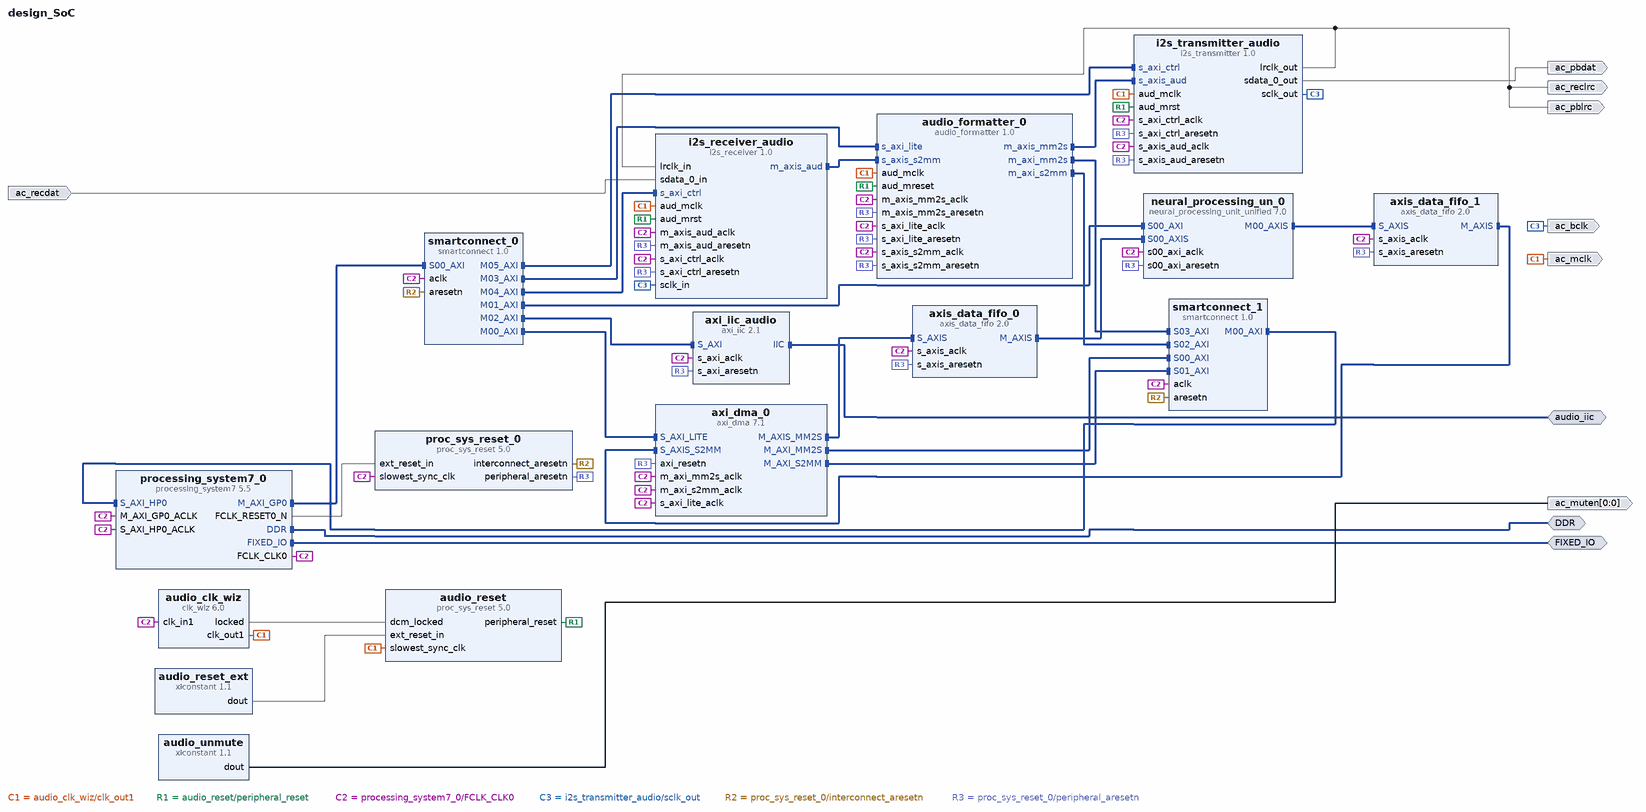
[diagram p0: block diagram of the top level]
# Vivado block design design_SoC, xc7z020clg400-1, Vivado 2024.2
create_bd_design design_SoC

create_bd_intf_port -mode Master -vlnv xilinx.com:interface:ddrx_rtl:1.0 DDR
create_bd_intf_port -mode Master -vlnv xilinx.com:display_processing_system7:fixedio_rtl:1.0 FIXED_IO
create_bd_intf_port -mode Master -vlnv xilinx.com:interface:iic_rtl:1.0 audio_iic
create_bd_port -dir O -type clk ac_mclk
set_property -dict {CONFIG.FREQ_HZ 12288982} [get_bd_ports ac_mclk]
create_bd_port -dir O -from 0 -to 0 ac_muten
create_bd_port -dir O ac_pbdat
create_bd_port -dir I ac_recdat
create_bd_port -dir O -type clk ac_bclk
set_property -dict {CONFIG.FREQ_HZ 2048000} [get_bd_ports ac_bclk]
create_bd_port -dir O ac_pblrc
create_bd_port -dir O ac_reclrc

create_bd_cell -type ip -vlnv xilinx.com:ip:proc_sys_reset:5.0 proc_sys_reset_0
create_bd_cell -type ip -vlnv xilinx.com:ip:axis_data_fifo:2.0 axis_data_fifo_0
create_bd_cell -type ip -vlnv xilinx.com:ip:axis_data_fifo:2.0 axis_data_fifo_1
set_property -dict {CONFIG.HAS_TKEEP 1 CONFIG.HAS_TLAST 1 CONFIG.HAS_TSTRB 0} [get_bd_cells axis_data_fifo_1]
create_bd_cell -type ip -vlnv xilinx.com:ip:smartconnect:1.0 smartconnect_0
set_property -dict {CONFIG.NUM_MI 6 CONFIG.NUM_SI 1} [get_bd_cells smartconnect_0]
create_bd_cell -type ip -vlnv xilinx.com:ip:axi_dma:7.1 axi_dma_0
set_property -dict {CONFIG.c_include_sg 0 CONFIG.c_sg_length_width 24} [get_bd_cells axi_dma_0]
create_bd_cell -type ip -vlnv xilinx.com:ip:smartconnect:1.0 smartconnect_1
set_property -dict {CONFIG.NUM_SI 4} [get_bd_cells smartconnect_1]
create_bd_cell -type ip -vlnv xilinx.com:ip:processing_system7:5.5 processing_system7_0
set_property -dict [list \
  CONFIG.PCW_APU_PERIPHERAL_FREQMHZ 667 \
  CONFIG.PCW_ENET0_ENET0_IO {MIO 16 .. 27} \
  CONFIG.PCW_ENET0_GRP_MDIO_ENABLE 1 \
  CONFIG.PCW_ENET0_GRP_MDIO_IO {MIO 52 .. 53} \
  CONFIG.PCW_ENET0_PERIPHERAL_ENABLE 1 \
  CONFIG.PCW_ENET0_RESET_ENABLE 0 \
  CONFIG.PCW_ENET_RESET_ENABLE 1 \
  CONFIG.PCW_ENET_RESET_SELECT {Share reset pin} \
  CONFIG.PCW_FPGA0_PERIPHERAL_FREQMHZ 75 \
  CONFIG.PCW_GPIO_MIO_GPIO_ENABLE 1 \
  CONFIG.PCW_GPIO_MIO_GPIO_IO MIO \
  CONFIG.PCW_I2C_RESET_ENABLE 0 \
  CONFIG.PCW_PRESET_BANK1_VOLTAGE {LVCMOS 1.8V} \
  CONFIG.PCW_QSPI_GRP_FBCLK_ENABLE 1 \
  CONFIG.PCW_QSPI_GRP_FBCLK_IO {MIO 8} \
  CONFIG.PCW_QSPI_GRP_SINGLE_SS_ENABLE 1 \
  CONFIG.PCW_QSPI_GRP_SINGLE_SS_IO {MIO 1 .. 6} \
  CONFIG.PCW_QSPI_PERIPHERAL_ENABLE 1 \
  CONFIG.PCW_QSPI_QSPI_IO {MIO 1 .. 6} \
  CONFIG.PCW_SD0_GRP_CD_ENABLE 1 \
  CONFIG.PCW_SD0_GRP_CD_IO {MIO 47} \
  CONFIG.PCW_SD0_GRP_WP_ENABLE 0 \
  CONFIG.PCW_SD0_PERIPHERAL_ENABLE 1 \
  CONFIG.PCW_SD0_SD0_IO {MIO 40 .. 45} \
  CONFIG.PCW_SDIO_PERIPHERAL_FREQMHZ 50 \
  CONFIG.PCW_SINGLE_QSPI_DATA_MODE x4 \
  CONFIG.PCW_UART1_PERIPHERAL_ENABLE 1 \
  CONFIG.PCW_UART1_UART1_IO {MIO 48 .. 49} \
  CONFIG.PCW_UART_PERIPHERAL_FREQMHZ 100 \
  CONFIG.PCW_UIPARAM_DDR_FREQ_MHZ 533.333333 \
  CONFIG.PCW_UIPARAM_DDR_MEMORY_TYPE {DDR 3 (Low Voltage)} \
  CONFIG.PCW_UIPARAM_DDR_PARTNO {MT41K256M16 RE-125} \
  CONFIG.PCW_USB0_PERIPHERAL_ENABLE 1 \
  CONFIG.PCW_USB0_RESET_ENABLE 1 \
  CONFIG.PCW_USB0_RESET_IO {MIO 46} \
  CONFIG.PCW_USB0_USB0_IO {MIO 28 .. 39} \
  CONFIG.PCW_USB_RESET_ENABLE 1 \
  CONFIG.PCW_USB_RESET_SELECT {Share reset pin} \
  CONFIG.PCW_USE_S_AXI_HP0 1 \
] [get_bd_cells processing_system7_0]
# 296 more settings of processing_system7_0 are not shown: defaults, MIO pin electricals, DDR timing, and values the tool derives
create_bd_cell -type ip -vlnv xilinx.com:ip:axi_iic:2.1 axi_iic_audio
create_bd_cell -type ip -vlnv xilinx.com:ip:clk_wiz:6.0 audio_clk_wiz
set_property -dict [list \
  CONFIG.CLKOUT1_REQUESTED_OUT_FREQ 12.288 \
  CONFIG.PRIM_IN_FREQ 76.923080 \
  CONFIG.USE_RESET false \
] [get_bd_cells audio_clk_wiz]
create_bd_cell -type ip -vlnv xilinx.com:ip:proc_sys_reset:5.0 audio_reset
create_bd_cell -type ip -vlnv xilinx.com:ip:xlconstant:1.1 audio_reset_ext
set_property -dict {CONFIG.CONST_VAL 1 CONFIG.CONST_WIDTH 1} [get_bd_cells audio_reset_ext]
create_bd_cell -type ip -vlnv xilinx.com:ip:xlconstant:1.1 audio_unmute
set_property -dict {CONFIG.CONST_VAL 1 CONFIG.CONST_WIDTH 1} [get_bd_cells audio_unmute]
create_bd_cell -type ip -vlnv xilinx.com:ip:i2s_receiver:1.0 i2s_receiver_audio
set_property -dict [list \
  CONFIG.C_32BIT_LR 1 \
  CONFIG.C_DEPTH 128 \
  CONFIG.C_DWIDTH 16 \
  CONFIG.C_IS_MASTER 0 \
  CONFIG.C_NUM_CHANNELS 2 \
] [get_bd_cells i2s_receiver_audio]
create_bd_cell -type ip -vlnv xilinx.com:ip:i2s_transmitter:1.0 i2s_transmitter_audio
set_property -dict [list \
  CONFIG.C_32BIT_LR 1 \
  CONFIG.C_DEPTH 128 \
  CONFIG.C_DWIDTH 16 \
  CONFIG.C_IS_MASTER 1 \
  CONFIG.C_NUM_CHANNELS 2 \
] [get_bd_cells i2s_transmitter_audio]
create_bd_cell -type ip -vlnv xilinx.com:ip:audio_formatter:1.0 audio_formatter_0
set_property -dict [list \
  CONFIG.C_INCLUDE_MM2S 1 \
  CONFIG.C_INCLUDE_S2MM 1 \
  CONFIG.C_MAX_NUM_CHANNELS_MM2S 2 \
  CONFIG.C_MAX_NUM_CHANNELS_S2MM 2 \
  CONFIG.C_MM2S_ADDR_WIDTH 32 \
  CONFIG.C_MM2S_ASYNC_CLOCK 0 \
  CONFIG.C_MM2S_DATAFORMAT 3 \
  CONFIG.C_PACKING_MODE_MM2S 0 \
  CONFIG.C_PACKING_MODE_S2MM 0 \
  CONFIG.C_S2MM_ADDR_WIDTH 32 \
  CONFIG.C_S2MM_ASYNC_CLOCK 0 \
  CONFIG.C_S2MM_DATAFORMAT 1 \
] [get_bd_cells audio_formatter_0]
create_bd_cell -type ip -vlnv xilinx.com:user:neural_processing_unit_unified:7.0 neural_processing_un_0

# ---- connections ----

connect_bd_intf_net [get_bd_intf_pins audio_formatter_0/m_axi_mm2s] [get_bd_intf_pins smartconnect_1/S03_AXI]
connect_bd_intf_net [get_bd_intf_pins audio_formatter_0/m_axi_s2mm] [get_bd_intf_pins smartconnect_1/S02_AXI]
connect_bd_intf_net [get_bd_intf_pins audio_formatter_0/m_axis_mm2s] [get_bd_intf_pins i2s_transmitter_audio/s_axis_aud]
connect_bd_intf_net [get_bd_intf_pins axis_data_fifo_0/S_AXIS] [get_bd_intf_pins axi_dma_0/M_AXIS_MM2S]
connect_bd_intf_net [get_bd_intf_pins axi_dma_0/M_AXI_MM2S] [get_bd_intf_pins smartconnect_1/S00_AXI]
connect_bd_intf_net [get_bd_intf_pins axi_dma_0/M_AXI_S2MM] [get_bd_intf_pins smartconnect_1/S01_AXI]
connect_bd_intf_net [get_bd_intf_ports audio_iic] [get_bd_intf_pins axi_iic_audio/IIC]
connect_bd_intf_net [get_bd_intf_pins axis_data_fifo_0/M_AXIS] [get_bd_intf_pins neural_processing_un_0/S00_AXIS]
connect_bd_intf_net [get_bd_intf_pins axis_data_fifo_1/M_AXIS] [get_bd_intf_pins axi_dma_0/S_AXIS_S2MM]
connect_bd_intf_net [get_bd_intf_pins i2s_receiver_audio/m_axis_aud] [get_bd_intf_pins audio_formatter_0/s_axis_s2mm]
connect_bd_intf_net [get_bd_intf_pins neural_processing_un_0/M00_AXIS] [get_bd_intf_pins axis_data_fifo_1/S_AXIS]
connect_bd_intf_net [get_bd_intf_ports DDR] [get_bd_intf_pins processing_system7_0/DDR]
connect_bd_intf_net [get_bd_intf_ports FIXED_IO] [get_bd_intf_pins processing_system7_0/FIXED_IO]
connect_bd_intf_net [get_bd_intf_pins processing_system7_0/M_AXI_GP0] [get_bd_intf_pins smartconnect_0/S00_AXI]
connect_bd_intf_net [get_bd_intf_pins smartconnect_0/M00_AXI] [get_bd_intf_pins axi_dma_0/S_AXI_LITE]
connect_bd_intf_net [get_bd_intf_pins smartconnect_0/M01_AXI] [get_bd_intf_pins neural_processing_un_0/S00_AXI]
connect_bd_intf_net [get_bd_intf_pins smartconnect_0/M02_AXI] [get_bd_intf_pins axi_iic_audio/S_AXI]
connect_bd_intf_net [get_bd_intf_pins smartconnect_0/M03_AXI] [get_bd_intf_pins audio_formatter_0/s_axi_lite]
connect_bd_intf_net [get_bd_intf_pins smartconnect_0/M04_AXI] [get_bd_intf_pins i2s_receiver_audio/s_axi_ctrl]
connect_bd_intf_net [get_bd_intf_pins smartconnect_0/M05_AXI] [get_bd_intf_pins i2s_transmitter_audio/s_axi_ctrl]
connect_bd_intf_net [get_bd_intf_pins processing_system7_0/S_AXI_HP0] [get_bd_intf_pins smartconnect_1/M00_AXI]
connect_bd_net [get_bd_ports ac_recdat] [get_bd_pins i2s_receiver_audio/sdata_0_in]
connect_bd_net [get_bd_pins audio_clk_wiz/clk_out1] \
  [get_bd_ports ac_mclk] [get_bd_pins audio_reset/slowest_sync_clk] [get_bd_pins audio_formatter_0/aud_mclk] \
  [get_bd_pins i2s_receiver_audio/aud_mclk] [get_bd_pins i2s_transmitter_audio/aud_mclk]
connect_bd_net [get_bd_pins audio_clk_wiz/locked] [get_bd_pins audio_reset/dcm_locked]
connect_bd_net [get_bd_pins audio_reset_ext/dout] [get_bd_pins audio_reset/ext_reset_in]
connect_bd_net [get_bd_pins audio_reset/peripheral_reset] \
  [get_bd_pins audio_formatter_0/aud_mreset] [get_bd_pins i2s_receiver_audio/aud_mrst] \
  [get_bd_pins i2s_transmitter_audio/aud_mrst]
connect_bd_net [get_bd_pins audio_unmute/dout] [get_bd_ports ac_muten]
connect_bd_net -net clk_wiz_0_clk_out1 [get_bd_pins processing_system7_0/FCLK_CLK0] \
  [get_bd_pins proc_sys_reset_0/slowest_sync_clk] [get_bd_pins axis_data_fifo_0/s_axis_aclk] \
  [get_bd_pins smartconnect_0/aclk] [get_bd_pins axi_dma_0/s_axi_lite_aclk] [get_bd_pins axi_dma_0/m_axi_mm2s_aclk] \
  [get_bd_pins axi_dma_0/m_axi_s2mm_aclk] [get_bd_pins axis_data_fifo_1/s_axis_aclk] [get_bd_pins smartconnect_1/aclk] \
  [get_bd_pins processing_system7_0/S_AXI_HP0_ACLK] [get_bd_pins processing_system7_0/M_AXI_GP0_ACLK] \
  [get_bd_pins axi_iic_audio/s_axi_aclk] [get_bd_pins audio_clk_wiz/clk_in1] [get_bd_pins audio_formatter_0/s_axi_lite_aclk] \
  [get_bd_pins audio_formatter_0/s_axis_s2mm_aclk] [get_bd_pins audio_formatter_0/m_axis_mm2s_aclk] \
  [get_bd_pins i2s_receiver_audio/s_axi_ctrl_aclk] [get_bd_pins i2s_receiver_audio/m_axis_aud_aclk] \
  [get_bd_pins i2s_transmitter_audio/s_axi_ctrl_aclk] [get_bd_pins i2s_transmitter_audio/s_axis_aud_aclk] \
  [get_bd_pins neural_processing_un_0/s00_axi_aclk]
connect_bd_net [get_bd_pins i2s_transmitter_audio/lrclk_out] \
  [get_bd_ports ac_pblrc] [get_bd_ports ac_reclrc] [get_bd_pins i2s_receiver_audio/lrclk_in]
connect_bd_net [get_bd_pins i2s_transmitter_audio/sclk_out] [get_bd_ports ac_bclk] [get_bd_pins i2s_receiver_audio/sclk_in]
connect_bd_net [get_bd_pins i2s_transmitter_audio/sdata_0_out] [get_bd_ports ac_pbdat]
connect_bd_net [get_bd_pins proc_sys_reset_0/interconnect_aresetn] [get_bd_pins smartconnect_0/aresetn] [get_bd_pins smartconnect_1/aresetn]
connect_bd_net [get_bd_pins proc_sys_reset_0/peripheral_aresetn] \
  [get_bd_pins axis_data_fifo_0/s_axis_aresetn] [get_bd_pins axis_data_fifo_1/s_axis_aresetn] \
  [get_bd_pins axi_dma_0/axi_resetn] [get_bd_pins axi_iic_audio/s_axi_aresetn] \
  [get_bd_pins audio_formatter_0/s_axi_lite_aresetn] [get_bd_pins audio_formatter_0/s_axis_s2mm_aresetn] \
  [get_bd_pins audio_formatter_0/m_axis_mm2s_aresetn] [get_bd_pins i2s_receiver_audio/s_axi_ctrl_aresetn] \
  [get_bd_pins i2s_receiver_audio/m_axis_aud_aresetn] [get_bd_pins i2s_transmitter_audio/s_axi_ctrl_aresetn] \
  [get_bd_pins i2s_transmitter_audio/s_axis_aud_aresetn] [get_bd_pins neural_processing_un_0/s00_axi_aresetn]
connect_bd_net [get_bd_pins processing_system7_0/FCLK_RESET0_N] [get_bd_pins proc_sys_reset_0/ext_reset_in]

# ---- address map ----
assign_bd_address -offset 0x00000000 -range 1G -target_address_space [get_bd_addr_spaces audio_formatter_0/m_axi_mm2s] [get_bd_addr_segs processing_system7_0/S_AXI_HP0/HP0_DDR_LOWOCM]
assign_bd_address -offset 0x00000000 -range 1G -target_address_space [get_bd_addr_spaces audio_formatter_0/m_axi_s2mm] [get_bd_addr_segs processing_system7_0/S_AXI_HP0/HP0_DDR_LOWOCM]
assign_bd_address -offset 0x00000000 -range 1G -target_address_space [get_bd_addr_spaces axi_dma_0/Data_MM2S] [get_bd_addr_segs processing_system7_0/S_AXI_HP0/HP0_DDR_LOWOCM]
assign_bd_address -offset 0x00000000 -range 1G -target_address_space [get_bd_addr_spaces axi_dma_0/Data_S2MM] [get_bd_addr_segs processing_system7_0/S_AXI_HP0/HP0_DDR_LOWOCM]
assign_bd_address -offset 0x40400000 -range 64K -target_address_space [get_bd_addr_spaces processing_system7_0/Data] [get_bd_addr_segs axi_dma_0/S_AXI_LITE/Reg]
assign_bd_address -offset 0x41600000 -range 64K -target_address_space [get_bd_addr_spaces processing_system7_0/Data] [get_bd_addr_segs axi_iic_audio/S_AXI/Reg]
assign_bd_address -offset 0x43C00000 -range 64K -target_address_space [get_bd_addr_spaces processing_system7_0/Data] [get_bd_addr_segs neural_processing_un_0/s00_axi/reg0]
assign_bd_address -offset 0x43C10000 -range 64K -target_address_space [get_bd_addr_spaces processing_system7_0/Data] [get_bd_addr_segs audio_formatter_0/s_axi_lite/reg0]
assign_bd_address -offset 0x43C20000 -range 64K -target_address_space [get_bd_addr_spaces processing_system7_0/Data] [get_bd_addr_segs i2s_receiver_audio/s_axi_ctrl/Reg]
assign_bd_address -offset 0x43C30000 -range 64K -target_address_space [get_bd_addr_spaces processing_system7_0/Data] [get_bd_addr_segs i2s_transmitter_audio/s_axi_ctrl/Reg]

validate_bd_design
save_bd_design
